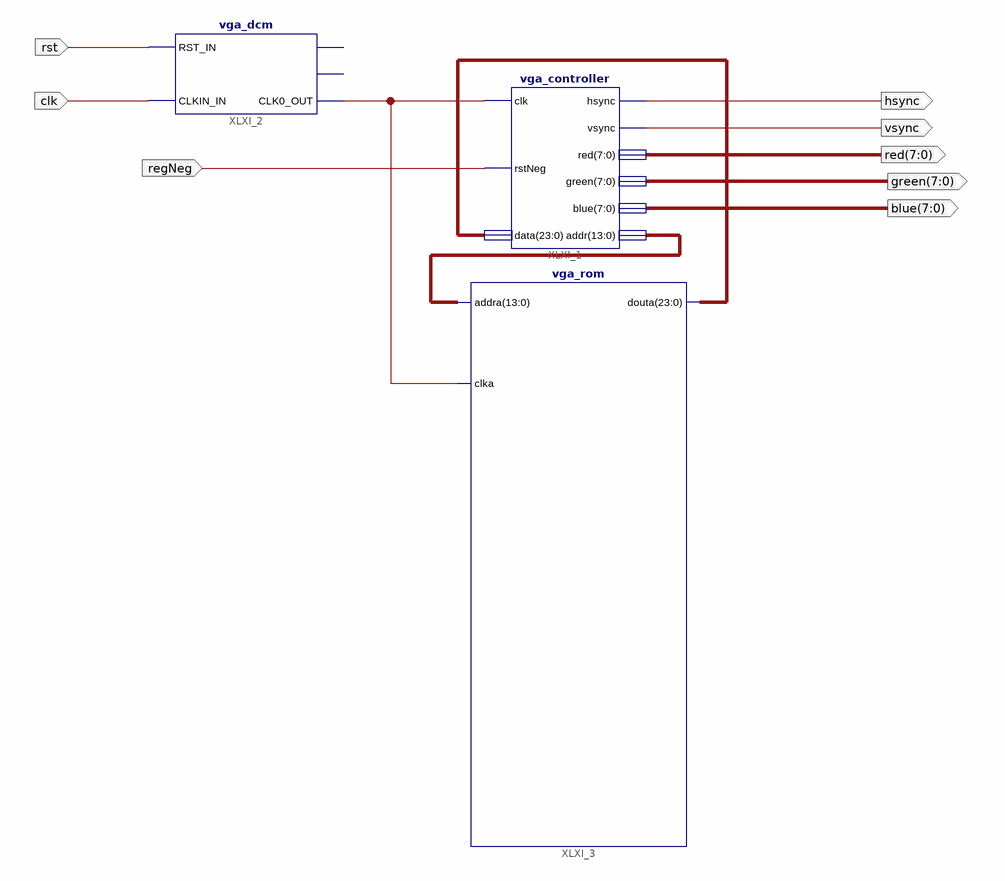
[diagram p0: schematic sheet 1]
// Xilinx ISE schematic vga_top.sch (spartan3) as structural Verilog: 3 symbols, 8 ports
module vga_top (
  input  regNeg,
  input  rst,
  input  clk,
  output hsync,
  output vsync,
  output [7:0] red,
  output [7:0] green,
  output [7:0] blue
);

  wire XLXN_2;
  wire [13:0] XLXN_3;
  wire [23:0] XLXN_4;

  vga_controller XLXI_1 (
    .clk(XLXN_2), .rstNeg(regNeg), .data(XLXN_4), .hsync(hsync), .vsync(vsync), .red(red), .green(green),
    .blue(blue), .addr(XLXN_3));
  vga_dcm XLXI_2 (.RST_IN(rst), .CLKIN_IN(clk), .CLK0_OUT(XLXN_2));  // open: LOCKED_OUT, CLKIN_IBUFG_OUT
  vga_rom XLXI_3 (.addra(XLXN_3), .clka(XLXN_2), .douta(XLXN_4));
endmodule
